# EAGLE schematic Alight_main_board (EAGLE 7.6.0)

## Sheet 1 of 2
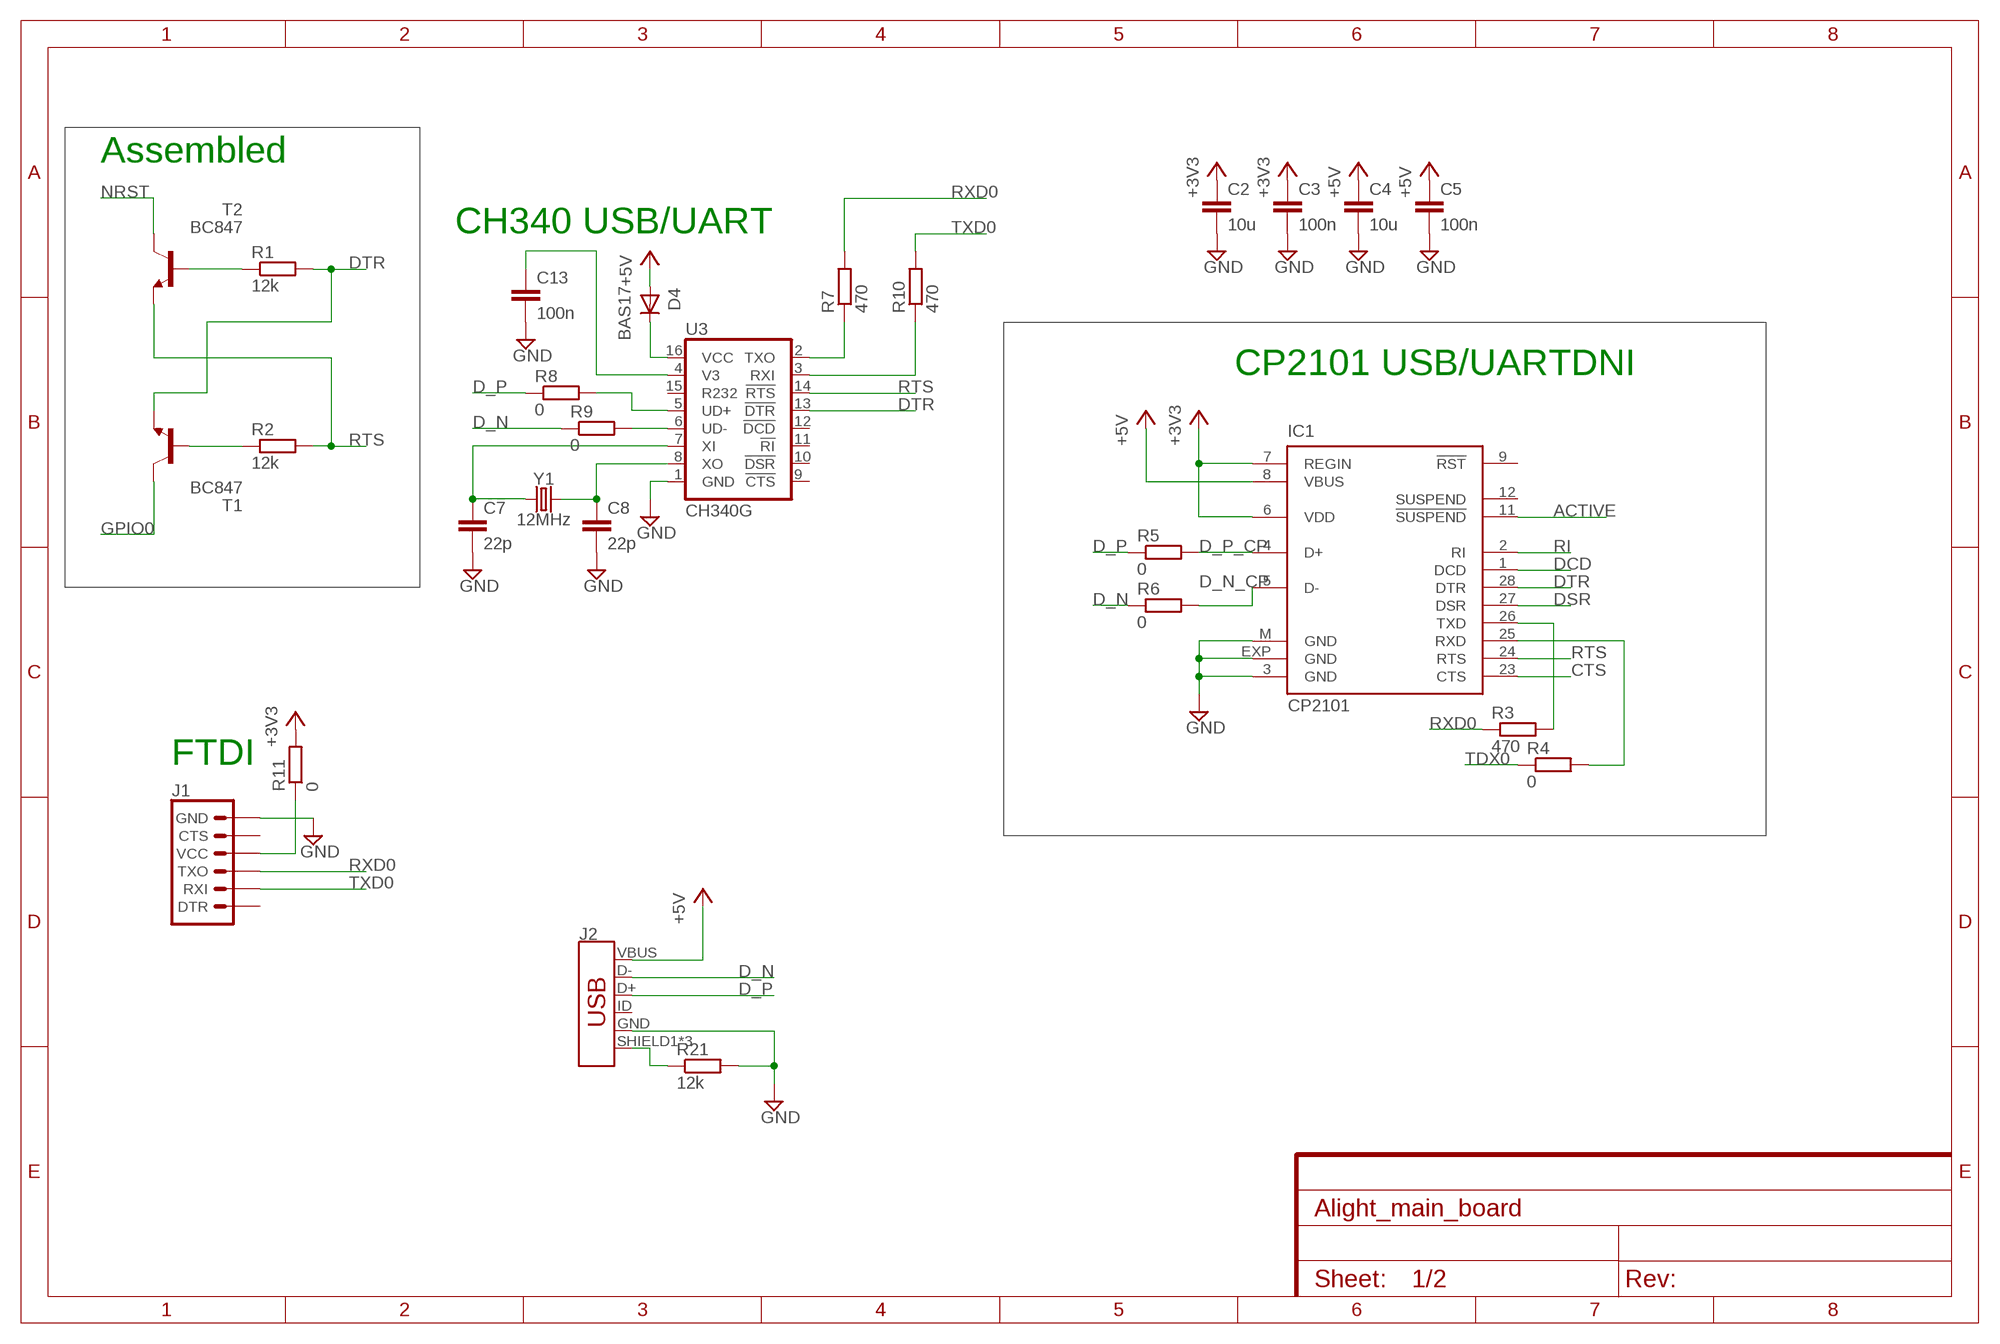
[diagram p0: schematic, sheet 1]

### Parts
C2  10u  C-EUC0603K  [C0603K]
C3  100n  C-EUC0603K  [C0603K]
C4  10u  C-EUC0603K  [C0603K]
C5  100n  C-EUC0603K  [C0603K]
C7  22p  C-EUC0402  [C0402]
C8  22p  C-EUC0402  [C0402]
C13  100n  C-EUC0603K  [C0603K]
D4  BAS17  [SOT23]
IC1  CP2101  CP210X_USB_UART  [MLP28]
J1  6_PIN_SERIAL_TARGETLONGPADS  [1X06_LONGPADS]
J2  USB_MICRO-B_FEMALE-SMT  [USB-B-MICRO-SMD]
R1  12k  R-EU_R0603  [R0603]
R2  12k  R-EU_R0603  [R0603]
R3  470  R-EU_R0603  [R0603]
R4  0  R-EU_R0603  [R0603]
R5  0  R-EU_R0603  [R0603]
R6  0  R-EU_R0603  [R0603]
R7  470  R-EU_R0603  [R0603]
R8  0  R-EU_R0603  [R0603]
R9  0  R-EU_R0603  [R0603]
R10  470  R-EU_R0603  [R0603]
R11  0  R-EU_R0603  [R0603]
R21  12k  R-EU_R0603  [R0603]
T1  BC847  [SOT23]
T2  BC847  [SOT23]
U3  CH340G  CH340GSMD  [SO016]
Y1  12MHz  CRYSTALSMD-HC49UP  [HC49UP]

### Nets
+3V3: C2.1 C3.1 IC1.6(VDD) IC1.7(REGIN) R11.2 ; also sheet 2
+5V: C4.1 C5.1 D4.1(A) IC1.8(VBUS) J2.VBUS ; also sheet 2
ACTIVE: IC1.11(!SUSPEND)
CTS: IC1.23(CTS)
D_N: J2.D- R6.1 R9.1
D_N_CP: IC1.5(D-) R6.2
D_P: J2.D+ R5.1 R8.1
D_P_CP: IC1.4(D+) R5.2
DCD: IC1.1(DCD)
DSR: IC1.27(DSR)
DTR: IC1.28(DTR) R1.2 T1.2(E) U3.13(!DTR)
GND: C2.2 C3.2 C4.2 C5.2 C7.2 C8.2 C13.2 IC1.3(GND) IC1.EXP(GND) IC1.M(GND) J1.6(GND) J2.GND R21.2 U3.1(GND) ; also sheet 2
GPIO0: T1.3(C)
N$1: R1.1 T2.1(B)
N$2: R2.1 T1.1(B)
N$4: R7.1 U3.2(TXO)
N$5: R10.1 U3.3(RXI)
N$6: R8.2 U3.5(UD+)
N$7: R9.2 U3.6(UD-)
N$8: C7.1 U3.7(XI) Y1.1
N$9: C13.1 U3.4(V3)
N$10: C8.1 U3.8(XO) Y1.2
N$11: J1.4(VCC) R11.1
N$15: D4.3(K) U3.16(VCC)
N$17: J2.SHIELD1(SHIELD) J2.SHIELD2(SHIELD) J2.SHIELD3(SHIELD) R21.1
NRST: T2.3(C)
RI: IC1.2(RI)
RTS: IC1.24(RTS) R2.2 T2.2(E) U3.14(!RTS)
RXD0: J1.3(TXO) R3.1 R7.2 ; also sheet 2
RXD0_CP2101IN: IC1.26(TXD) R3.2
TDX0: R4.1
TXD0: J1.2(RXI) R10.2 ; also sheet 2
TXD0_CP2101: IC1.25(RXD) R4.2
Unconnected: IC1.9(!RST) IC1.12(SUSPEND) J1.1(DTR) J1.5(CTS) J2.ID U3.9(!CTS) U3.10(!DSR) U3.11(!RI) U3.12(!DCD) U3.15(R232)

### Notes on the sheet
- Assembled
- CH340 USB/UART
- CP2101 USB/UART | DNI
- FTDI

## Sheet 2 of 2
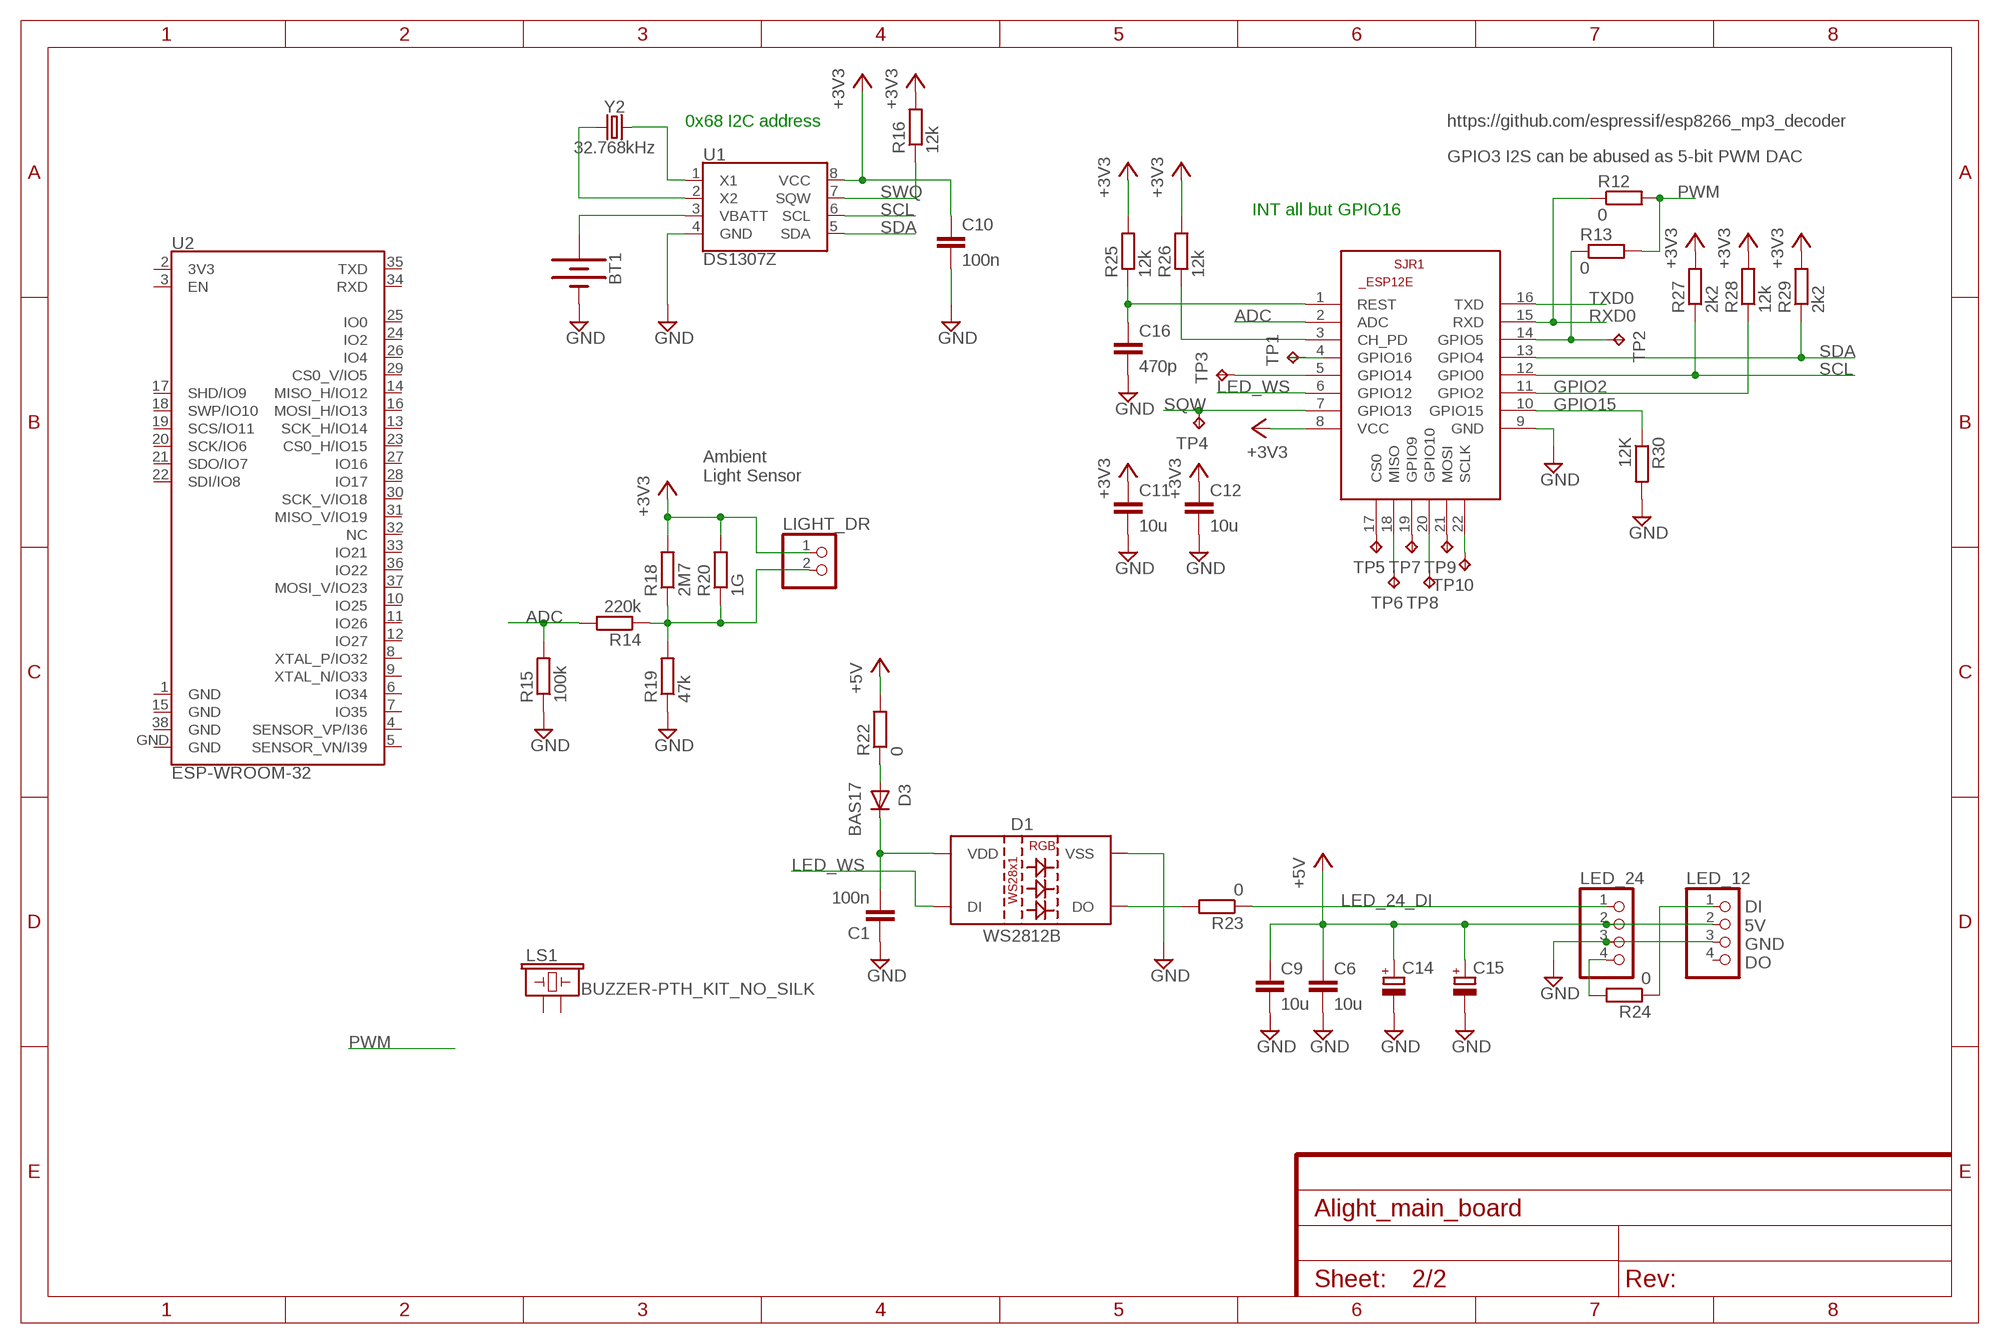
[diagram p1: schematic, sheet 2]

### Parts
BT1  BATTERY-20MM_PTH_KIT  [BATTCOM_20MM_PTH_KIT]
C1  100n  C-EUC0603K  [C0603K]
C6  10u  C-EUC0603K  [C0603K]
C9  10u  C-EUC0603K  [C0603K]
C10  100n  C-EUC0603K  [C0603K]
C11  10u  C-EUC0603K  [C0603K]
C12  10u  C-EUC0603K  [C0603K]
C14  CPOL-EU153CLV-0605  [153CLV-0605]
C15  CPOL-EU153CLV-0605  [153CLV-0605]
C16  470p  C-EUC0603K  [C0603K]
D1  WS2812B  [WS2812B]
D3  BAS17  [SOT23]
LED_12  PINHD-1X4  [1X04]
LED_24  PINHD-1X4  [1X04]
LIGHT_DR  PINHD-1X2  [1X02]
LS1  BUZZER-PTH_KIT_NO_SILK  [BUZZER-12MM-NS-KIT]
R12  0  R-EU_R0603  [R0603]
R13  0  R-EU_R0603  [R0603]
R14  220k  R-EU_R0603  [R0603]
R15  100k  R-EU_R0603  [R0603]
R16  12k  R-EU_R0603  [R0603]
R18  2M7  R-EU_R0603  [R0603]
R19  47k  R-EU_R0603  [R0603]
R20  1G  R-EU_R0603  [R0603]
R22  0  R-EU_R0603  [R0603]
R23  0  R-EU_R0603  [R0603]
R24  0  R-EU_R0603  [R0603]
R25  12k  R-EU_R0603  [R0603]
R26  12k  R-EU_R0603  [R0603]
R27  2k2  R-EU_R0603  [R0603]
R28  12k  R-EU_R0603  [R0603]
R29  2k2  R-EU_R0603  [R0603]
R30  12K  R-EU_R0603  [R0603]
SJR1  ESP8266-12EESP12E  [ESP8266-ESP12E]
TP1  TPTP10R  [TP10R]
TP2  TPTP10R  [TP10R]
TP3  TPTP10R  [TP10R]
TP4  TPTP10R  [TP10R]
TP5  TPTP10R  [TP10R]
TP6  TPTP10R  [TP10R]
TP7  TPTP10R  [TP10R]
TP8  TPTP10R  [TP10R]
TP9  TPTP10R  [TP10R]
TP10  TPTP10R  [TP10R]
U1  DS1307Z  [SO08-0.15]
U2  ESP-WROOM-32  [ESP-WROOM-32]
Y2  32.768kHz  CRYSTAL-32.768KHZSMD-3.2X1.5  [CRYSTAL-SMD-3.2X1.5MM]

### Nets
+3V3: C10.1 C11.1 C12.1 LIGHT_DR.1 R16.2 R18.2 R20.2 R25.2 R26.2 R27.2 R28.2 R29.2 SJR1.8(VCC) U1.8(VCC) ; also sheet 1
+5V: C6.1 C9.1 C14.+ C15.+ LED_12.2 LED_24.2 R22.2 ; also sheet 1
ADC: R14.2 R15.2 SJR1.2(ADC)
GND: BT1.2(-) C1.1 C6.2 C9.2 C10.2 C11.2 C12.2 C14.- C15.- C16.2 D1.3(VSS) LED_12.3 LED_24.3 R15.1 R19.1 R30.2 SJR1.9(GND) U1.4(GND) ; also sheet 1
GPIO2: R28.1 SJR1.11(GPIO2)
GPIO15: R30.1 SJR1.10(GPIO15)
LED_12DI: LED_12.1 R24.1
LED_24_DI: LED_24.1 R23.1
LED_24_DO: LED_24.4 R24.2
LED_WS: D1.4(DI) SJR1.6(GPIO12)
N$3: C1.2 D1.1(VDD) D3.3(K)
N$12: R13.1 SJR1.14(GPIO5) TP2.TP
N$13: SJR1.4(GPIO16) TP1.TP
N$14: LIGHT_DR.2 R14.1 R18.1 R19.2 R20.1
N$16: D3.1(A) R22.1
N$18: D1.2(DO) R23.2
N$19: C16.1 R25.1 SJR1.1(REST)
N$20: R26.1 SJR1.3(CH_PD)
N$21: SJR1.5(GPIO14) TP3.TP
N$23: SJR1.17(CS0) TP5.TP
N$24: SJR1.18(MISO) TP6.TP
N$25: SJR1.19(GPIO9) TP7.TP
N$26: SJR1.20(GPIO10) TP8.TP
N$27: SJR1.21(MOSI) TP9.TP
N$28: SJR1.22(SCLK) TP10.TP
N$29: BT1.1(+) U1.3(VBATT)
N$30: U1.1(X1) Y2.P$2
N$31: U1.2(X2) Y2.P$1
PWM: R12.2 R13.2
RXD0: R12.1 SJR1.15(RXD) ; also sheet 1
SCL: R27.1 SJR1.12(GPIO0) U1.6(SCL)
SDA: R29.1 SJR1.13(GPIO4) U1.5(SDA)
SQW: SJR1.7(GPIO13) TP4.TP
SWQ: R16.1 U1.7(SQW)
TXD0: SJR1.16(TXD) ; also sheet 1
Unconnected: LED_12.4 LS1.+ LS1.- U2.1(GND) U2.2(3V3) U2.3(EN) U2.4(SENSOR_VP/I36) U2.5(SENSOR_VN/I39) U2.6(IO34) U2.7(IO35) U2.8(XTAL_P/IO32) U2.9(XTAL_N/IO33) U2.10(IO25) U2.11(IO26) U2.12(IO27) U2.13(SCK_H/IO14) U2.14(MISO_H/IO12) U2.15(GND) U2.16(MOSI_H/IO13) U2.17(SHD/IO9) U2.18(SWP/IO10) U2.19(SCS/IO11) U2.20(SCK/IO6) U2.21(SDO/IO7) U2.22(SDI/IO8) U2.23(CS0_H/IO15) U2.24(IO2) U2.25(IO0) U2.26(IO4) U2.27(IO16) U2.28(IO17) U2.29(CS0_V/IO5) U2.30(SCK_V/IO18) U2.31(MISO_V/IO19) U2.32(NC) U2.33(IO21) U2.34(RXD) U2.35(TXD) U2.36(IO22) U2.37(MOSI_V/IO23) U2.38(GND) U2.GND

### Notes on the sheet
- 0x68 I2C address | https://github.com/espressif/esp8266_mp3_decoder
- GPIO3 I2S can be abused as 5-bit PWM DAC
- INT all but GPIO16
- Ambient
  Light Sensor
- DI
  5V
  GND
  DO

## Library data of the parts
BT1 = SparkFun-Batteries:BATTERY: Battery - Single Cell A variety of battery chemistries, sizes, and footprints. Device List: 20MM_PTH - Coin Cell Battery Holder - 20mm (PTH) <https://www.sparkfun.com/products/783> 20MM_PTH_KIT- Coin Cell battery Holder - 20 mm (PTH) <http://www.sparkfun.com/products/783>kit version with special mask 6.8MM_PTH - Coin Cell Battery Holder - 6.8MM(SMD) <https://www.digikey.com/product-detail/en/seiko-instruments/MS621FE-FL11E/728-1057-ND/1889208?WT.srch=1&gclid=CNOQ5a6LzdQCFZS2wAodXCkE0g> 12MM_SMD - Coin Cell Battery Holder - 12mm (SMD) <https://www.sparkfun.com/products/10592> 12MM_PTH - Coin Cell Battery Holder - 12mm (PTH) <https://www.sparkfun.com/products/7948> 20MM_SMD - 20mm Coin Cell Battery Holder (SMD) (2 legs) Used on the Big Time Watch Kit <https://www.sparkfun.com/products/11734> 20MM_SMD_4LEGS - Coin Cell Battery Holder - 20mm (SMD) <https://www.sparkfun.com/products/11892> 20MM_SMD_4LEGS_OVERPASTE - Coin Cell Battery Holder - 20mm (SMD) <https://www.sparkfun.com/products/11892> (Over-paste on the legs) 24.5MM_PTH - Coin Cell Battery Holder - 24.5mm (PTH) <https://www.sparkfun.com/products/8863> 9V - 9V Battery Holder - PC Mount Used on the SparkFun SparkPunk Sound Kit <https://www.sparkfun.com/products/11177> and SparkFun SparkPunk Sequencer Kit <https://www.sparkfun.com/products/12707> 18650 - Battery Holder - 18650 (PTH) <https://www.sparkfun.com/products/13113> AA - Battery Holder - 1xAA (PTH) <https://www.sparkfun.com/products/7949> AAA - Battery Holder - 1xAAA (PTH) <https://www.sparkfun.com/products/12718> AA_KIT - Battery Holder - 1xAA (PTH) <https://www.sparkfun.com/products/7949> Special kit package - pads only have exposed copper on one side of the board. AAA_KIT - Battery Holder - 1xAAA (PTH) <https://www.sparkfun.com/products/12718> Special kit package - pads only have exposed copper on one side of the board.
C1-C13 C16 = resistor:C-EU: CAPACITOR, European symbol
C14 C15 = resistor:CPOL-EU: POLARIZED CAPACITOR, European symbol
D1 = SparkFun-LED:WS2812B: WS2812B SMD addressable RGB LED 5x5mm SMD LED with built-in controller IC. Color: Red/Green/Blue mC Rating: RGB: 390, 660, 180 mcd Forward Voltage: RGB: 2.0, 3.0, 3.0 V Packages:WS2812B SparkFun Products: Blynk Board - ESP8266 <https://www.sparkfun.com/products/13794>; PROD_ID: DIO-12503
D3 D4 = nxp_60:BAS17: Low-voltage stabistor Low-voltage stabilization diode in a small SOT23 plastic package. AAL Eindhoven MK
IC1 = SparkFun-Retired:CP210X_USB_UART: Single-Chip USB to UART Bridge Source: www.silabs.com .. CP2101.pdf / cp2102.pdf. Spark Fun Electronics SKU : COM-00310 RETIRED: IC-00865; PROD_ID: COM-00310
J1 = SparkFun-Connectors:6_PIN_SERIAL_TARGET: 6-pin header connection for use with the "FTDI BASIC" pinout - TARGET SIDE. Also known as "Arduino Serial Program Header". It is used to mate with our FTDI Basic serial programmers using the Arduino IDE. Note, this device has "TARGET" in the name. It is intended to be used on a design that contains a target micro-controller that you wish to program. The "sister" device, named "CABLE" is inteneded to be used on a design that usually lives on the end of your USB cable and prvides the converter chip (FTDI232 or FTDI231x) to commnicate serial RX/TX. You can populate with some of these: Break Away Headers - Straight <https://www.sparkfun.com/products/116> (PRT-00116) For reference (or to suit your programming needs) check out these designs: SparkFun FTDI Basic Breakout - 5V <https://www.sparkfun.com/products/9716> (DEV-09716) SparkFun FTDI Basic Breakout - 3.3V <https://www.sparkfun.com/products/9873> (DEV-09873) SparkFun FTDI SmartBasic <https://www.sparkfun.com/products/12935> (DEV-12935) SparkFun Beefy 3 - FTDI Basic Breakout <https://www.sparkfun.com/products/13746> (DEV-13746)
J2 = SparkFun-Connectors:USB_MICRO-B: USB Type Micro-B Connector Male/female and PTH/SMT variants SparkFun Products: SparkFun microB USB Breakout <https://www.sparkfun.com/products/12035> SparkFun USB microB Plug Breakout <https://www.sparkfun.com/products/10031> SparkFun ESP8266 Thing <https://www.sparkfun.com/products/13231>; PROD_ID: CONN-11752
LED_12 LED_24 = pinhead:PINHD-1X4: PIN HEADER
LIGHT_DR = pinhead:PINHD-1X2: PIN HEADER
LS1 = SparkFun-Electromechanical:BUZZER: Buzzer Small round buzzers that operate around the audible 2kHz range. You can use these as speakers to create simple music or user interfaces. Variant Overview: PTH - Mini Speaker - PC Mount 12mm 2.048kHz <https://www.sparkfun.com/products/7950> PTH_KIT - Mini Speaker - PC Mount 12mm 2.048kHz <https://www.sparkfun.com/products/7950> KIT simplifies soldering by adding stop mask to one side of the pads. PTH_NO_SILK - Mini Speaker - PC Mount 12mm 2.048kHz <https://www.sparkfun.com/products/7950> No silkscreen indicator of buzzer outline. PTH_KIT_NO_SILK - Mini Speaker - PC Mount 12mm 2.048kHz <https://www.sparkfun.com/products/7950> KIT package w/o silkscreen SMD - Buzzer Audio Magnetic (CCV-084B16) SMD buzzer used on, e.g. the LilyPad Buzzer <https://www.sparkfun.com/products/8463> and RFID USB Reader <https://www.sparkfun.com/products/9963>. SMD_KIT - Buzzer Audio Magnetic (CCV-084B16) SMD Buzzer with elongated pins to make soldering easier. Used on the SparkFun Simon Says - Surface Mount Soldering Kit <https://www.sparkfun.com/products/10935>.; PROD_ID: COMP-08253; SF_SKU: COM-07950
R1-R16 R18-R30 = resistor:R-EU_: RESISTOR, European symbol
SJR1 = esp12e:ESP8266-12E: ESP8266-12E Library for Eagle CAD The author not responsible for any damages or errors!. Created by Suhail jr.lt;/author>
T1 T2 = transistor-neu-to92:BC847: NPN TRANSISTOR
TP1-TP10 = testpad:TP: Test pad
U1 = SparkFun-Clocks:DS1307: Maxim DS1307 - I2C Real-time clock (RTC) The DS1307 serial real-time clock (RTC) is a low-power, full binary-coded decimal (BCD) clock/calendar plus 56 bytes of NV SRAM. Address and data are transferred serially through an I2C, bidirectional bus. The clock/calendar provides seconds, minutes, hours, day, date, month, and year information. SparkFun Products: Real Time Clock Module <https://www.sparkfun.com/products/12708> (BOB-12708) Datasheet <https://cdn.sparkfun.com/datasheets/BreakoutBoards/DS1307.pdf>; PROD_ID: IC-08138
U2 = SparkFun-RF:ESP-WROOM-32; PROD_ID: IC-13849
U3 = SparkFun-IC-Comms:CH340G: A simple USB 2.0 to Serial IC.; PROD_ID: IC-13498
Y1 = SparkFun-Clocks:CRYSTAL: Crystals (Generic) These are passive quartz crystals, which can be used as a clock source for a microcontroller. Crystal's are two-terminal devices. They require external "load" capacitors to generate an oscillating signal.
Y2 = SparkFun-Clocks:CRYSTAL-32.768KHZ: 32.768kHz Crystal Frequency: 32.768kHz Frequency Stability: ±20ppm Load Capacitance: 12.5pF (PTH-2X6 & SMD-3.2X1.5), 6pF (SMD-2X6) SparkFun Products: SparkFun BigTime Watch Kit <https://www.sparkfun.com/products/11734> SparkFun nRF52832 Breakout <https://www.sparkfun.com/products/13990> SparkFun Real Time Clock Module <https://www.sparkfun.com/products/12708>; PROD_ID: XTAL-13062